# EAGLE design MAD76 (EAGLE 7.7.0)

## Sheet 1 of 2
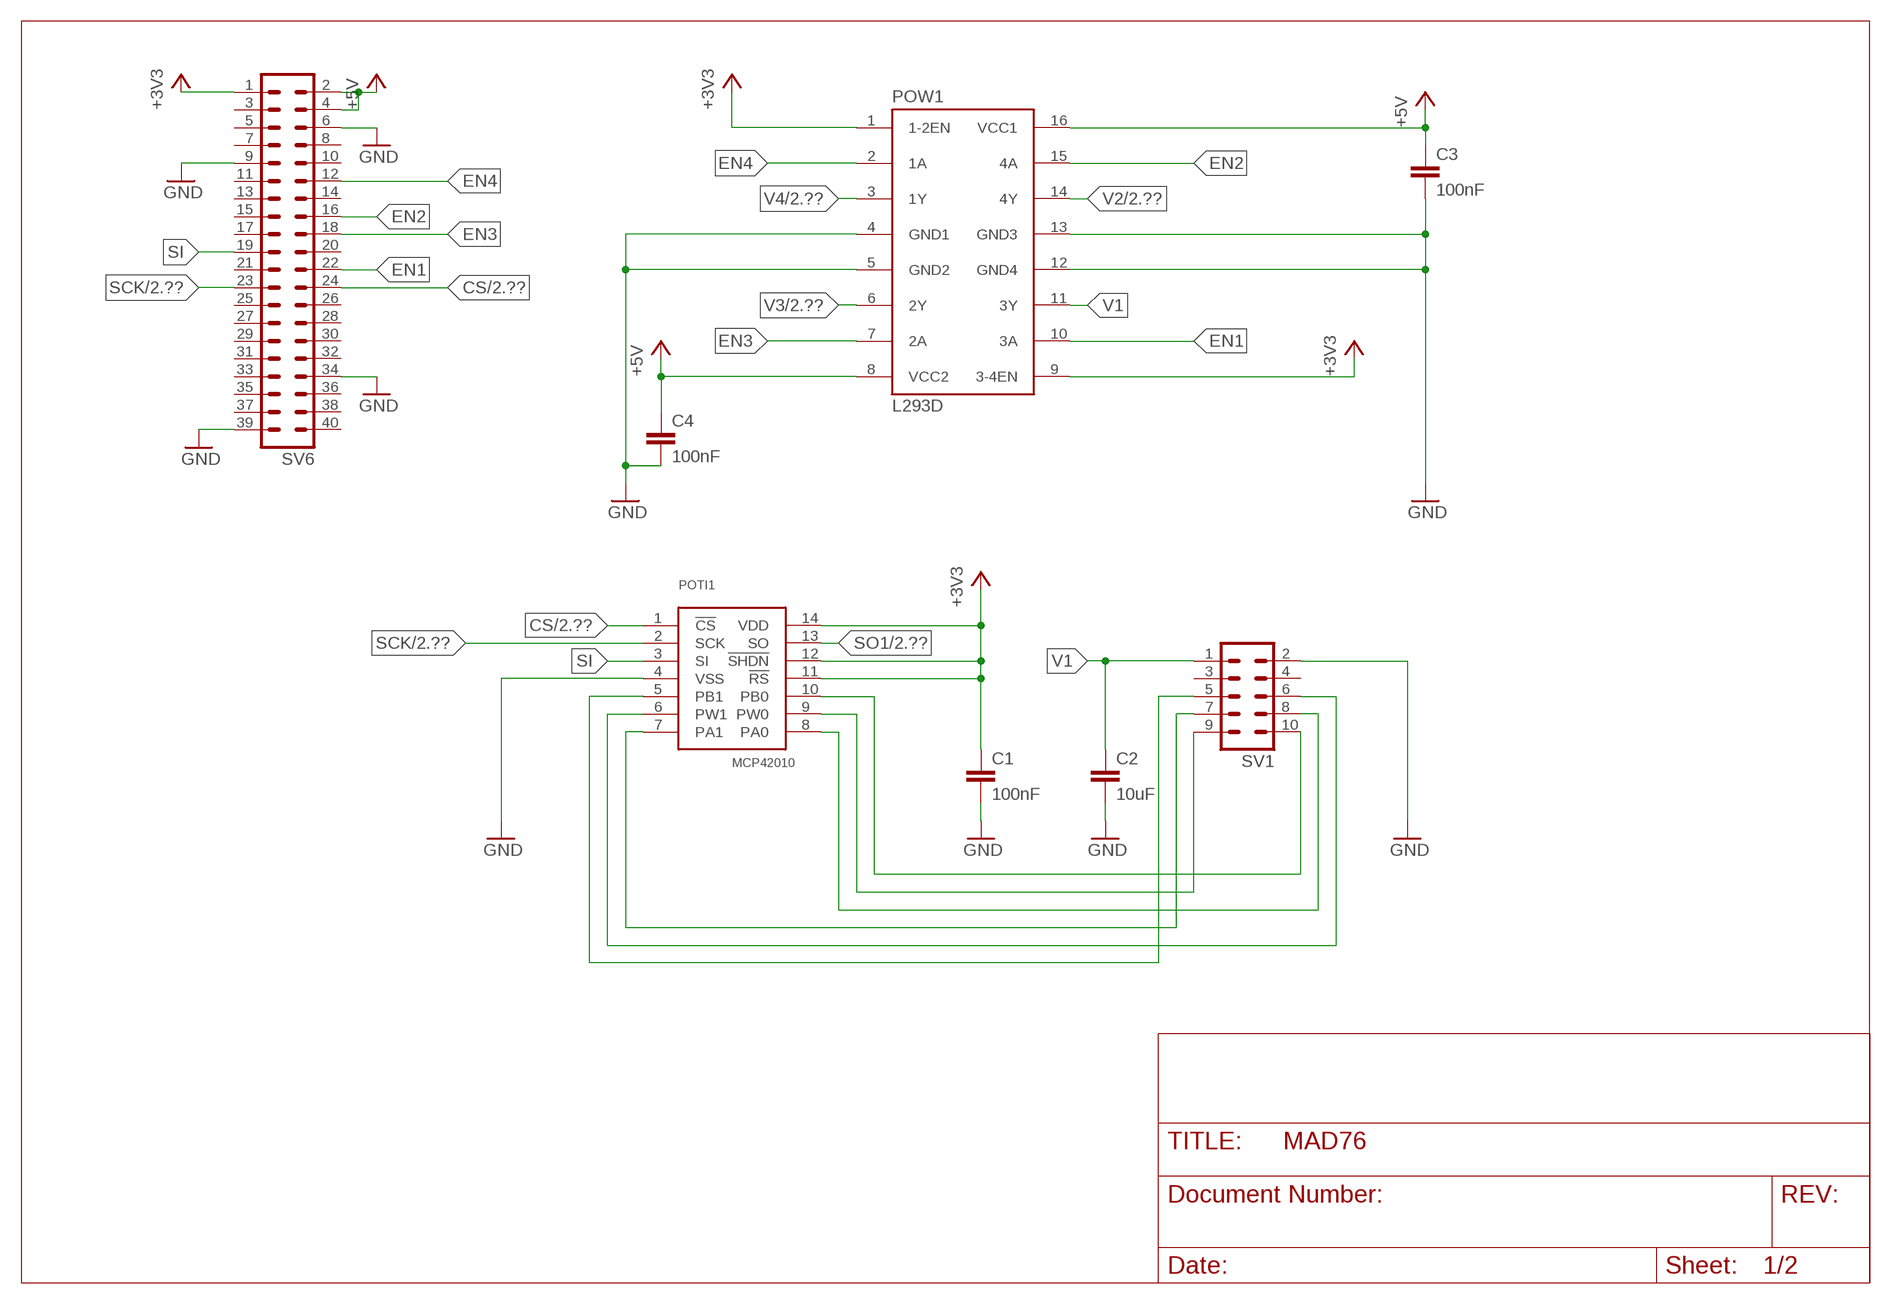
[diagram p0: schematic, sheet 1]

### Parts
C1  100nF  C-EUC0805  [C0805]
C2  10uF  C-EUC0805  [C0805]
C3  100nF  C-EUC0805  [C0805]
C4  100nF  C-EUC0805  [C0805]
POTI1  MCP42010  [DIL14]
POW1  L293D  [DIL16]
SV1  ML10  [ML10]
SV6  MA20-2W_RPI  [MA20-2W_RPI]

### Nets
+3V3: C1.1 POTI1.11(!RS) POTI1.12(!SHDN) POTI1.14(VDD) POW1.1(1-2EN) POW1.9(3-4EN) SV6.1 ; also sheet 2
+5V: C3.1 C4.1 POW1.8(VCC2) POW1.16(VCC1) SV6.2 SV6.4
CS: POTI1.1(!CS) SV6.24 ; also sheet 2
EN1: POW1.10(3A) SV6.22
EN2: POW1.15(4A) SV6.16
EN3: POW1.7(2A) SV6.18
EN4: POW1.2(1A) SV6.12
GND: C1.2 C2.2 C3.2 C4.2 POTI1.4(VSS) POW1.4(GND1) POW1.5(GND2) POW1.12(GND4) POW1.13(GND3) SV1.2 SV6.6 SV6.9 SV6.34 SV6.39 ; also sheet 2
PA1.0: POTI1.8(PA0) SV1.8
PA1.1: POTI1.7(PA1) SV1.7
PB1.0: POTI1.10(PB0) SV1.10
PB1.1: POTI1.5(PB1) SV1.5
PW1.0: POTI1.9(PW0) SV1.9
PW1.1: POTI1.6(PW1) SV1.6
SCK: POTI1.2(SCK) SV6.23 ; also sheet 2
SI: POTI1.3(SI) SV6.19
SO1: POTI1.13(SO) ; also sheet 2
V1: C2.1 POW1.11(3Y) SV1.1
V2: POW1.14(4Y) ; also sheet 2
V3: POW1.6(2Y) ; also sheet 2
V4: POW1.3(1Y) ; also sheet 2
Unconnected: SV1.3 SV1.4 SV6.3 SV6.5 SV6.7 SV6.8 SV6.10 SV6.11 SV6.13 SV6.14 SV6.15 SV6.17 SV6.20 SV6.21 SV6.25 SV6.26 SV6.27 SV6.28 SV6.29 SV6.30 SV6.31 SV6.32 SV6.33 SV6.35 SV6.36 SV6.37 SV6.38 SV6.40

## Sheet 2 of 2
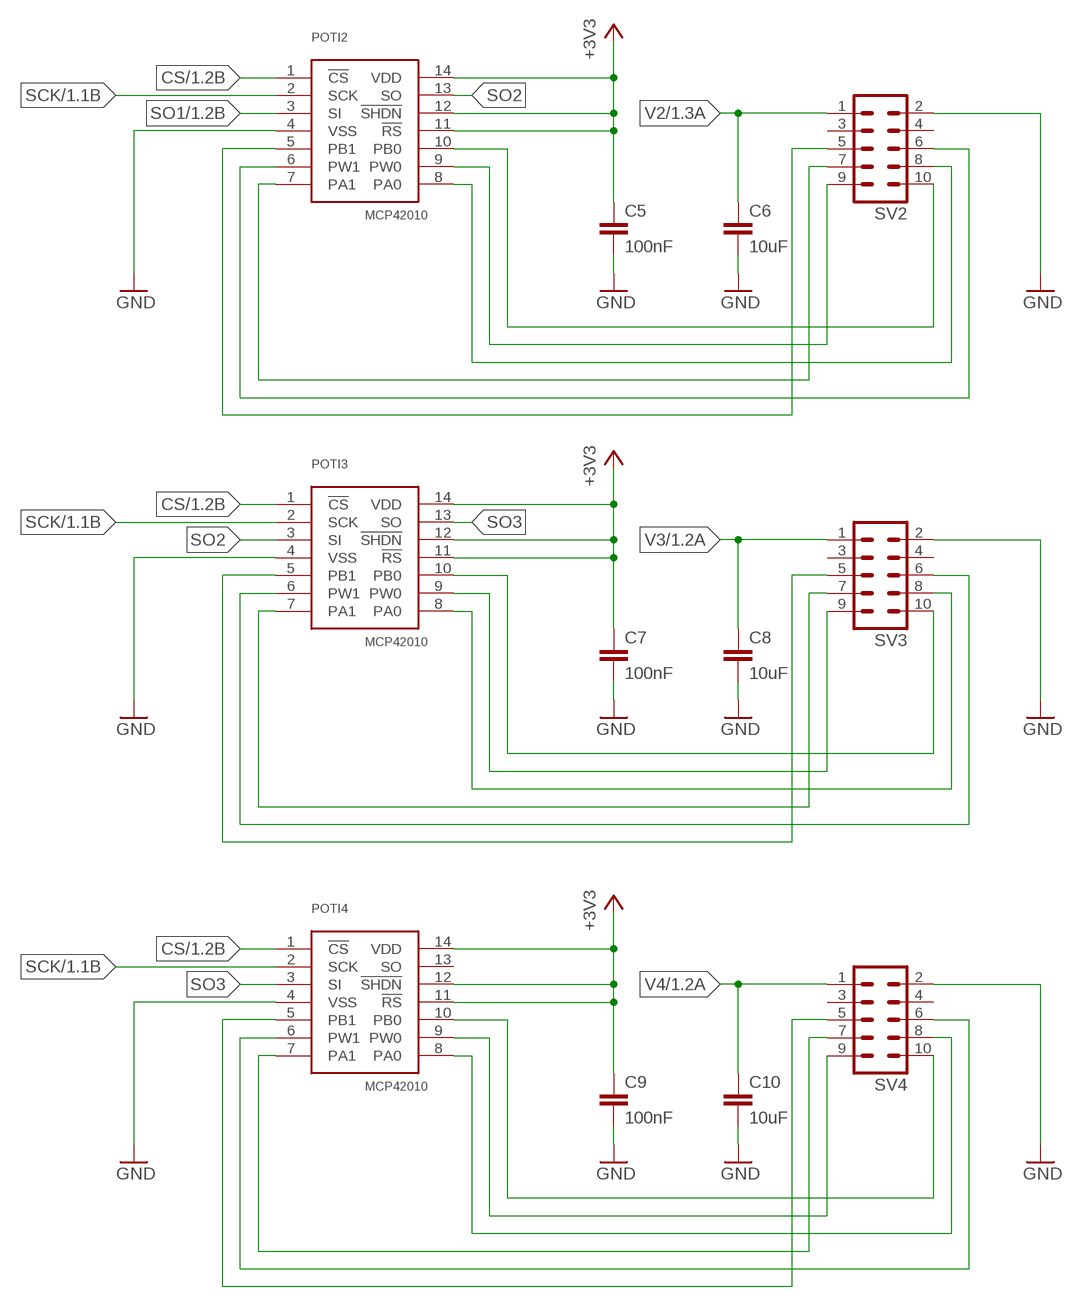
[diagram p1: schematic, sheet 2]

### Parts
C5  100nF  C-EUC0805  [C0805]
C6  10uF  C-EUC0805  [C0805]
C7  100nF  C-EUC0805  [C0805]
C8  10uF  C-EUC0805  [C0805]
C9  100nF  C-EUC0805  [C0805]
C10  10uF  C-EUC0805  [C0805]
POTI2  MCP42010  [DIL14]
POTI3  MCP42010  [DIL14]
POTI4  MCP42010  [DIL14]
SV2  ML10  [ML10]
SV3  ML10  [ML10]
SV4  ML10  [ML10]

### Nets
+3V3: C5.1 C7.1 C9.1 POTI2.11(!RS) POTI2.12(!SHDN) POTI2.14(VDD) POTI3.11(!RS) POTI3.12(!SHDN) POTI3.14(VDD) POTI4.11(!RS) POTI4.12(!SHDN) POTI4.14(VDD) ; also sheet 1
CS: POTI2.1(!CS) POTI3.1(!CS) POTI4.1(!CS) ; also sheet 1
GND: C5.2 C6.2 C7.2 C8.2 C9.2 C10.2 POTI2.4(VSS) POTI3.4(VSS) POTI4.4(VSS) SV2.2 SV3.2 SV4.2 ; also sheet 1
PA2.0: POTI2.8(PA0) SV2.8
PA2.1: POTI2.7(PA1) SV2.7
PA3.0: POTI3.8(PA0) SV3.8
PA3.1: POTI3.7(PA1) SV3.7
PA4.0: POTI4.8(PA0) SV4.8
PA4.1: POTI4.7(PA1) SV4.7
PB2.0: POTI2.10(PB0) SV2.10
PB2.1: POTI2.5(PB1) SV2.5
PB3.0: POTI3.10(PB0) SV3.10
PB3.1: POTI3.5(PB1) SV3.5
PB4.0: POTI4.10(PB0) SV4.10
PB4.1: POTI4.5(PB1) SV4.5
PW2.0: POTI2.9(PW0) SV2.9
PW2.1: POTI2.6(PW1) SV2.6
PW3.0: POTI3.9(PW0) SV3.9
PW3.1: POTI3.6(PW1) SV3.6
PW4.0: POTI4.9(PW0) SV4.9
PW4.1: POTI4.6(PW1) SV4.6
SCK: POTI2.2(SCK) POTI3.2(SCK) POTI4.2(SCK) ; also sheet 1
SO1: POTI2.3(SI) ; also sheet 1
SO2: POTI2.13(SO) POTI3.3(SI)
SO3: POTI3.13(SO) POTI4.3(SI)
V2: C6.1 SV2.1 ; also sheet 1
V3: C8.1 SV3.1 ; also sheet 1
V4: C10.1 SV4.1 ; also sheet 1
Unconnected: POTI4.13(SO) SV2.3 SV2.4 SV3.3 SV3.4 SV4.3 SV4.4

## Library data of the parts
C1-C10 = rcl:C-EU: CAPACITOR, European symbol
POTI1-POTI4 = sp2:MCP42010
POW1 = st-microelectronics:L293D: PUSH-PULL 4 CHANNEL DRIVER; MPN: L293D; OC_FARNELL: 9589619; OC_NEWARK: 56P8249
SV1-SV4 = con-ml:ML10: HARTING; OC_FARNELL: unknown; OC_NEWARK: unknown
SV6 = sp2:MA20-2W_RPI: PIN HEADER

## Net classes
1 power: width 0.152 mm, drill 0.61 mm, clearance 0.152 mm

## Board
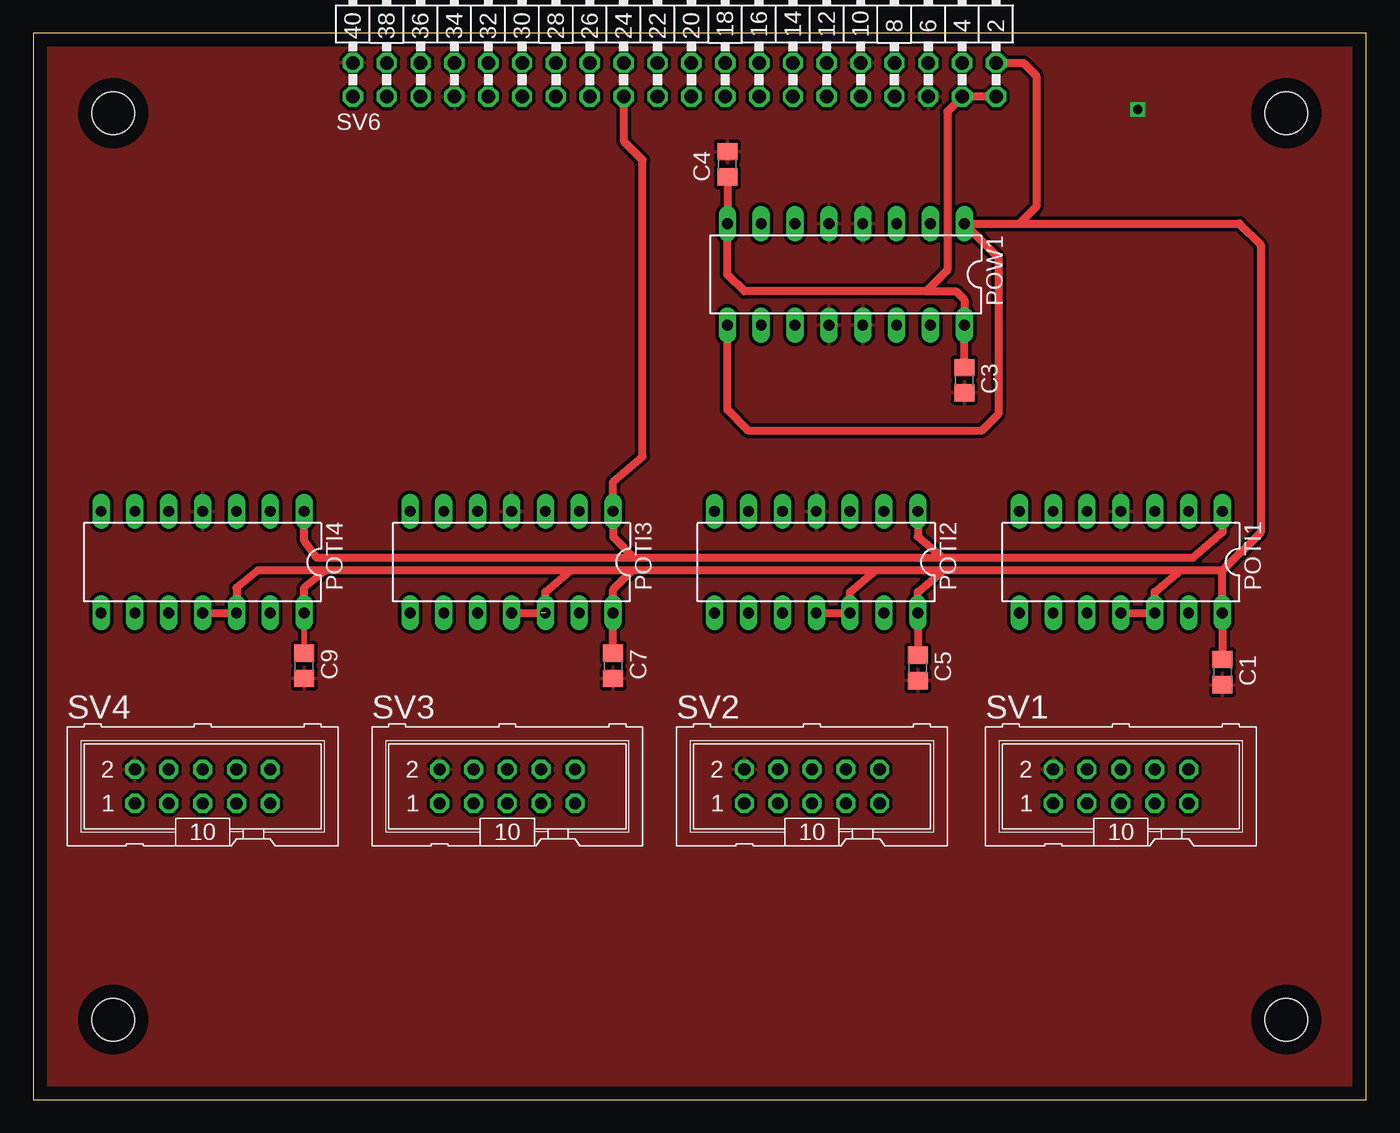
[diagram p2: board, top side]
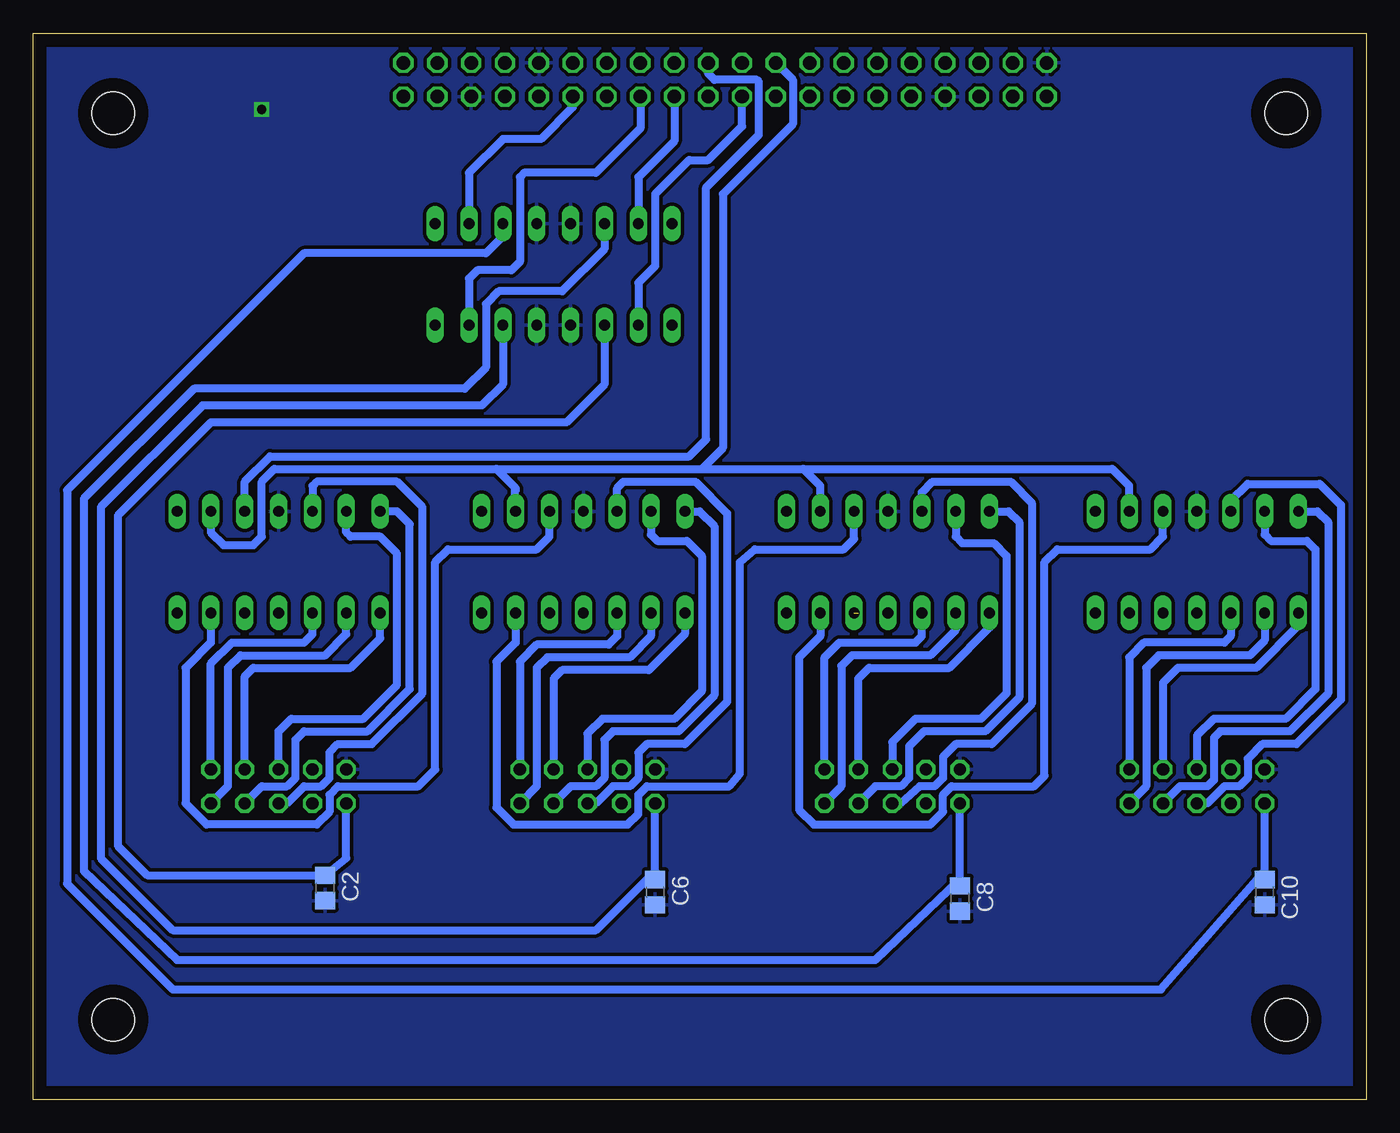
[diagram p3: board, bottom side, seen from below]

Size 100 x 80 mm. Coordinates in mm from the lower left corner, seen from the top.
Outline: 0,0 100,0 100,80 0,80 0,0
Copper layers (1*16): Top 0.035mm / dielectric 1.5mm / Bottom 0.035mm
Design rules "default *": minimum track width 10mil, minimum drill 24mil, track to track 8mil, track to pad 8mil, pad to pad 8mil, via to via 8mil, smd to smd 8mil, copper to edge 40mil, drill to drill 8mil, minimum pad ring 10mil, minimum via ring 8mil, stop-mask expansion 4mil, vias tented up to drill 0mil, thermal gap 10mil
Holes 3.2 mm at 6,74 94,74 94,6 6,6

### Footprints (pad centres in the part's own frame; a part is rotated, then mirrored left to right if it is on the bottom)
C0805 = smd 1.3 x 1.5: 1 -0.95,0; 2 0.95,0
DIL14 = drill 0.813 long: 1 -7.62,-3.81; 2 -5.08,-3.81; 3 -2.54,-3.81; 4 0,-3.81; 5 2.54,-3.81; 6 5.08,-3.81; 7 7.62,-3.81; 8 7.62,3.81; 9 5.08,3.81; 10 2.54,3.81; 11 0,3.81; 12 -2.54,3.81; 13 -5.08,3.81; 14 -7.62,3.81
DIL16 = drill 0.813 long: 1 -8.89,-3.81; 2 -6.35,-3.81; 3 -3.81,-3.81; 4 -1.27,-3.81; 5 1.27,-3.81; 6 3.81,-3.81; 7 6.35,-3.81; 8 8.89,-3.81; 9 8.89,3.81; 10 6.35,3.81; 11 3.81,3.81; 12 1.27,3.81; 13 -1.27,3.81; 14 -3.81,3.81; 15 -6.35,3.81; 16 -8.89,3.81
ML10 = drill 0.914 octagon: 1 -5.08,-1.27; 2 -5.08,1.27; 3 -2.54,-1.27; 4 -2.54,1.27; 5 0,-1.27; 6 0,1.27; 7 2.54,-1.27; 8 2.54,1.27; 9 5.08,-1.27; 10 5.08,1.27
MA20-2W_RPI = drill 1.016 octagon: 1 24.13,1.27; 2 24.13,-1.27; 3 21.59,1.27; 4 21.59,-1.27; 5 19.05,1.27; 6 19.05,-1.27; 7 16.51,1.27; 8 16.51,-1.27; 9 13.97,1.27; 10 13.97,-1.27; 11 11.43,1.27; 12 11.43,-1.27; 13 8.89,1.27; 14 8.89,-1.27; 15 6.35,1.27; 16 6.35,-1.27; 17 3.81,1.27; 18 3.81,-1.27; 19 1.27,1.27; 20 1.27,-1.27; 21 -1.27,1.27; 22 -1.27,-1.27; 23 -3.81,1.27; 24 -3.81,-1.27; 25 -6.35,1.27; 26 -6.35,-1.27; 27 -8.89,1.27; 28 -8.89,-1.27; 29 -11.43,1.27; 30 -11.43,-1.27; 31 -13.97,1.27; 32 -13.97,-1.27; 33 -16.51,1.27; 34 -16.51,-1.27; 35 -19.05,1.27; 36 -19.05,-1.27; 37 -21.59,1.27; 38 -21.59,-1.27; 39 -24.13,1.27; 40 -24.13,-1.27

### Placement (x,y rotation side)
C1  89.22,32.07 270 top
C2  78.11,15.88 270 bottom
C3  69.85,53.98 270 top
C4  52.07,70.17 90 top
C5  66.36,32.38 270 top
C6  53.34,15.56 270 bottom
C7  43.5,32.54 270 top
C8  30.48,15.08 270 bottom
C9  20.32,32.54 270 top
C10  7.62,15.56 270 bottom
POTI1  81.6,40.32 180 top
POTI2  58.74,40.32 180 top
POTI3  35.88,40.32 180 top
POTI4  12.7,40.32 180 top
POW1  60.96,61.91 180 top
SV1  81.6,23.5 0 top
SV2  58.42,23.5 0 top
SV3  35.56,23.5 0 top
SV4  12.7,23.5 0 top
SV6  48.1,76.52 0 top

### Tracks (layer width: path | path; a pad name or v marks a point on that pad's centre or on a via)
+3V3  (1 unrouted)
  Top 0.406: C9.1 POTI4.14
  Top 0.61: C1.1 POTI1.14 89.22,39.69 | 89.22,39.69 86.04,39.69 | 86.04,39.69 68.26,39.69 | 68.26,39.69 63.18,39.69 | 63.18,39.69 44.93,39.69 | 44.93,39.69 40.32,39.69 | 40.32,39.69 21.91,39.69 | 21.91,39.69 16.83,39.69 15.24,38.42 POTI4.12 POTI4.11 | POTI4.14 20.32,38.42 21.91,39.69 | POTI3.11 38.1,36.51 | POTI3.12 38.42,38.1 40.32,39.69 | 86.04,39.69 84.14,38.1 POTI1.12 POTI1.11 | 63.18,39.69 61.28,38.1 POTI2.12 POTI2.11 | 68.26,39.69 66.36,38.1 POTI2.14 C5.1 66.36,33.02 | 73.98,65.72 POW1.1 72.39,63.18 72.39,51.44 71.12,50.16 53.66,50.16 52.07,51.75 POW1.9 | 73.98,65.72 90.49,65.72 92.08,64.14 92.08,42.55 89.22,39.69 | SV6.1 74.3,77.79 75.25,76.83 75.25,66.99 73.98,65.72 | 44.93,39.69 43.5,38.26 POTI3.14 C7.1
+5V
  Top 0.61: C3.1 POW1.16 69.85,60.01 69.22,60.64 66.99,60.64 | C4.1 POW1.8 52.07,61.91 53.34,60.64 66.99,60.64 | 66.99,60.64 68.58,62.23 68.58,74.14 SV6.4 SV6.2
CS
  Top 0.61: POTI1.1 89.22,42.55 87,40.64 68.26,40.64 | 68.26,40.64 45.09,40.64 | 45.09,40.64 21.27,40.64 20.32,41.91 POTI4.1 | 45.09,40.64 43.5,42.23 POTI3.1 43.5,46.35 45.72,48.26 45.72,70.48 44.29,71.91 SV6.24 | POTI2.1 66.36,42.23 68.26,40.64
EN1
  Bottom 0.61: POW1.10 54.61,61.28 53.34,62.55 53.34,67.94 50.8,70.48 49.37,70.48 46.83,73.03 SV6.22
EN2
  Bottom 0.61: POW1.15 67.31,61.59 66.67,62.23 64.14,62.23 63.5,62.87 63.5,69.22 63.18,69.53 57.78,69.53 54.45,72.87 SV6.16
EN3
  Bottom 0.61: POW1.7 54.61,69.22 51.91,71.91 SV6.18
EN4
  Bottom 0.61: POW1.2 67.31,69.53 64.77,72.07 61.91,72.07 59.53,74.45 SV6.12
GND  (via drill 0.7)
  other vias: 82.87,74.3
  pour Bottom (isolate 0.254): 0.32,80.01 100.01,80.01 100.01,0 0.32,0
  pour Top (isolate 0.254): 0.32,80.01 100.01,80.01 100.01,0 0.32,0
PA1.0
  Bottom 0.61: SV1.8 84.14,31.75 83.5,32.38 76.2,32.38 73.98,34.61 POTI1.8
PA1.1
  Bottom 0.61: SV1.7 82.87,23.5 80.96,23.5 80.33,24.13 80.33,26.99 79.69,27.62 74.93,27.62 71.75,30.8 71.75,43.18 72.71,44.13 POTI1.7
PA2.0
  Bottom 0.61: POTI2.8 51.12,34.92 53.82,32.23 60.33,32.23 60.96,31.59 SV2.8
PA2.1
  Bottom 0.61: POTI2.7 50.01,44.13 48.9,43.02 48.9,30.32 51.59,27.62 56.52,27.62 57.15,26.99 57.15,24.13 57.78,23.5 59.69,23.5 SV2.7
PA3.0
  Bottom 0.61: SV3.8 38.1,31.59 37.31,32.38 31.27,32.38 28.26,35.4 POTI3.8
PA3.1
  Bottom 0.61: POTI3.7 26.83,44.13 26.04,43.34 26.04,30.16 28.57,27.62 33.18,27.62 34.29,26.51 34.29,24.13 34.92,23.5 36.83,23.5 SV3.7
PA4.0
  Bottom 0.61: POTI4.8 5.08,35.56 8.26,32.38 14.13,32.38 15.24,31.27 SV4.8
PA4.1
  Bottom 0.61: POTI4.7 3.65,44.13 2.86,43.34 2.86,30.48 5.71,27.62 10.95,27.62 11.43,27.15 11.43,23.97 11.91,23.5 13.97,23.5 SV4.7
PB1.0
  Bottom 0.406: POTI1.10 79.06,36.2
  Bottom 0.61: SV1.10 86.68,32.7 85.09,34.29 79.69,34.29 79.06,34.92 POTI1.10
PB1.1
  Bottom 0.61: SV1.5 80.96,22.23 79.69,23.5 78.42,23.5 77.79,24.13 77.79,26.04 77.15,26.67 74.61,26.67 70.8,30.48 70.8,44.45 72.71,46.35 78.74,46.35 79.06,46.04 POTI1.5
PB2.0
  Bottom 0.61: POTI2.10 56.2,34.77 56.83,34.13 62.23,34.13 63.5,32.86 SV2.10
PB2.1
  Bottom 0.61: POTI2.5 56.2,45.88 55.72,46.35 50.32,46.35 47.94,43.97 47.94,29.84 51.12,26.67 53.98,26.67 54.61,26.04 54.61,24.13 55.24,23.5 56.52,23.5 57.78,22.23 SV2.5
PB3.0
  Bottom 0.61: SV3.10 40.64,33.18 39.53,34.29 33.81,34.29 33.34,34.77 POTI3.10
PB3.1
  Bottom 0.61: POTI3.5 33.34,45.56 32.54,46.35 26.67,46.35 25.08,44.77 25.08,29.69 28.1,26.67 30.8,26.67 31.75,25.72 31.75,24.13 32.38,23.5 33.5,23.5 34.92,22.23 SV3.5
PB4.0
  Bottom 0.406: SV4.10 17.62,24.77
  Bottom 0.61: POTI4.10 10.16,34.77 10.64,34.29 16.67,34.29 17.78,33.18 SV4.10
PB4.1
  Bottom 0.61: POTI4.5 10.16,44.93 8.89,46.2 3.49,46.2 1.91,44.61 1.91,30 5.24,26.67 7.78,26.67 8.89,25.56 8.89,24.13 9.53,23.5 10.64,23.5 11.91,22.23 SV4.5
PW1.0
  Bottom 0.61: SV1.9 85.41,23.5 85.41,32.38 84.45,33.34 78.11,33.34 76.52,34.92 POTI1.9
PW1.1
  Bottom 0.61: SV1.6 81.6,27.62 80.64,28.57 75.25,28.57 72.71,31.11 72.71,40.96 73.98,42.23 76.2,42.23 76.52,42.55 POTI1.6
PW2.0
  Bottom 0.61: POTI2.9 53.66,34.77 55.24,33.18 61.44,33.18 62.23,32.38 62.23,23.5 SV2.9
PW2.1
  Bottom 0.61: POTI2.6 53.66,42.39 53.18,41.91 50.96,41.91 49.85,40.8 49.85,30.64 51.91,28.57 57.31,28.57 58.42,27.46 SV2.6
PW3.0
  Bottom 0.61: POTI3.9 30.8,35.24 32.7,33.34 38.58,33.34 39.37,32.54 39.37,23.5 SV3.9
PW3.1
  Bottom 0.61: POTI3.6 30.8,42.23 30.32,41.75 27.94,41.75 26.99,40.8 26.99,30.48 28.89,28.57 33.81,28.57 35.56,26.83 SV3.6
PW4.0
  Bottom 0.61: POTI4.9 7.62,34.45 8.73,33.34 15.56,33.34 16.51,32.38 16.51,23.5 SV4.9
PW4.1
  Bottom 0.61: POTI4.6 7.62,42.39 7.14,41.91 4.45,41.91 3.81,41.27 3.81,30.8 6.03,28.57 11.43,28.57 12.7,27.3 SV4.6
SCK
  Bottom 0.61: POTI1.2 86.68,42.55 85.72,41.59 83.5,41.59 82.87,42.23 82.87,46.35 81.92,47.31 65.25,47.31 | 63.82,43.5 POTI2.2 63.85,44.13 63.85,45.69 | 63.85,45.69 63.82,45.72 63.82,45.84 | POTI4.2 17.78,46.04 19.05,47.31 42.23,47.31 | 65.25,47.31 49.85,47.31 | 49.85,47.31 42.23,47.31 | 63.85,45.69 63.85,45.91 65.25,47.31 | POTI3.2 40.96,46.04 42.23,47.31 | SV6.23 43.02,76.52 43.02,73.18 48.26,67.94 48.26,48.9 49.85,47.31
SI
  Bottom 0.61: POTI1.3 84.14,46.35 82.23,48.26 50.8,48.26 49.53,49.53 49.53,68.42 45.56,72.39 45.56,76.36 45.72,76.52 48.9,76.52 49.37,76.99 SV6.19
SO1
  Bottom 0.61: POTI1.13 86.68,34.29 88.58,32.38 88.58,22.23 87,20.64 78.74,20.64 77.79,21.59 77.79,22.86 77.15,23.5 71.12,23.5 69.85,24.77 69.85,40.32 68.9,41.27 62.23,41.27 61.28,42.23 POTI2.3
SO2
  Bottom 0.61: POTI2.13 63.82,34.29 65.25,32.86 65.25,21.91 63.98,20.64 55.4,20.64 54.61,21.43 54.61,22.86 53.98,23.5 47.78,23.5 46.99,24.45 46.99,40.32 45.88,41.27 39.21,41.27 38.42,42.07 POTI3.3
SO3
  Bottom 0.61: POTI3.13 40.96,34.77 42.55,33.18 42.55,21.75 41.43,20.64 32.7,20.64 31.75,21.59 31.75,22.86 31.11,23.5 24.92,23.5 24.13,24.29 24.13,40.32 23.18,41.27 16.19,41.27 15.24,42.23 POTI4.3
V1
  Bottom 0.61: SV1.1 76.52,18.1 C2.1 91.44,16.83 93.66,19.05 93.66,43.81 86.68,50.8 60.01,50.8 57.15,53.66 POW1.11
V2
  Bottom 0.61: POW1.14 64.77,53.66 66.36,52.07 87.31,52.07 94.93,44.45 94.93,18.1 89.53,12.7 57.78,12.7 53.5,16.99 | 53.5,16.99 53.34,17.14 SV2.1 | C6.1 53.34,16.83 53.5,16.99
V3
  Bottom 0.61: POW1.6 57.15,63.82 60.33,60.64 65.09,60.64 66.04,59.69 66.04,54.93 67.63,53.34 87.95,53.34 96.2,45.09 96.2,17.14 89.22,10.48 36.83,10.48 30.48,16.51 | 30.48,16.51 SV3.1 | C8.1 30.48,16.51
V4
  Bottom 0.406: C10.1 7.62,17.3
  Bottom 0.61: SV4.1 7.62,17.3 7.62,17.14 15.4,8.26 89.53,8.26 97.47,16.19 97.47,45.72 79.69,63.5 66.04,63.5 64.77,64.77 POW1.3